# EAGLE schematic SOC_camera (EAGLE 6.2)

## Sheet 1 of 4: Alimentación
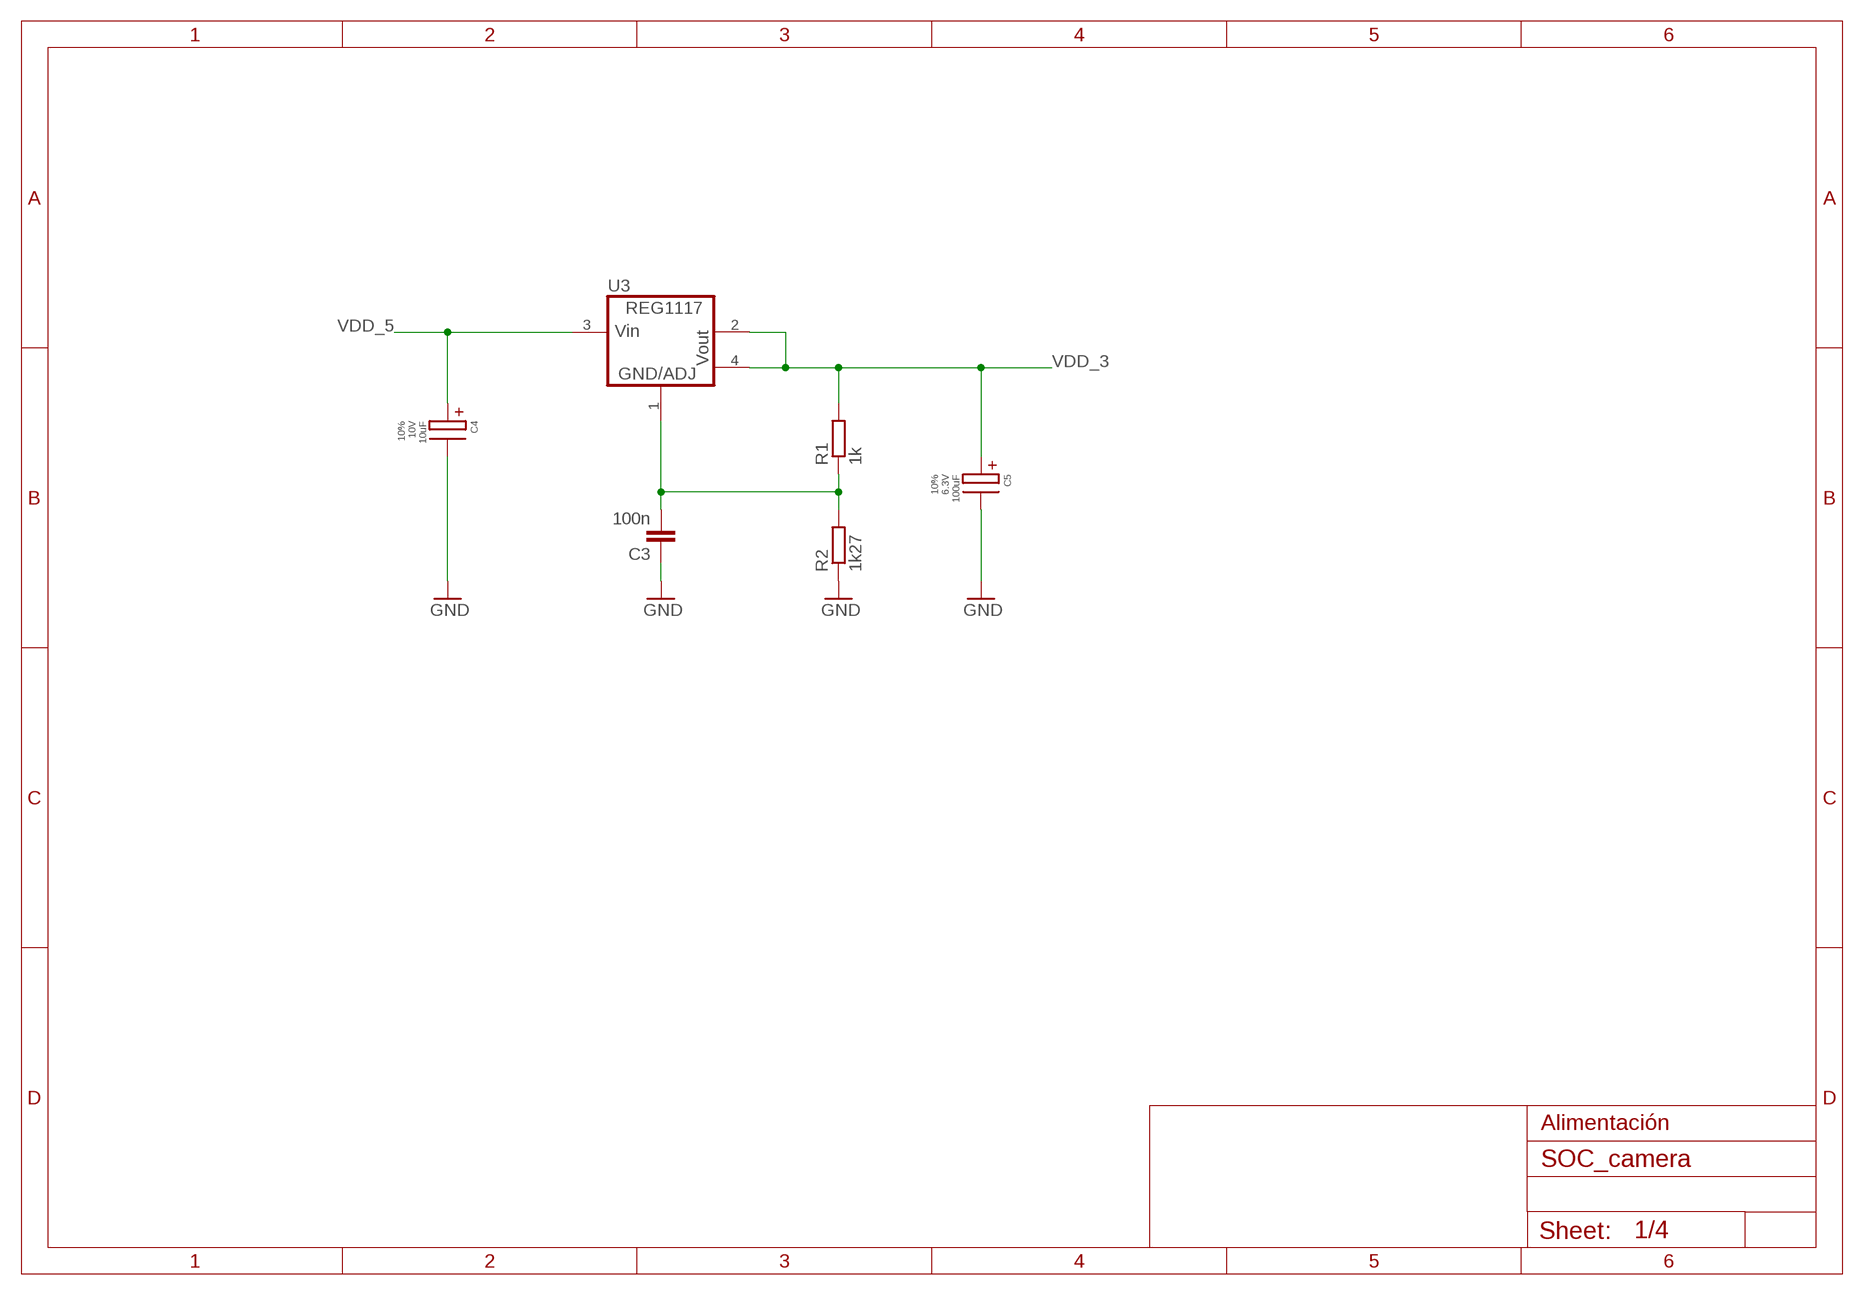
[diagram p0: schematic, sheet 1]

### Parts
C3  100n  C-EUC0603  [C0603]
C4  10uF  CPOL_TF-10U-10V-10%-B  [3528-21]
C5  100uF  CPOL_TF-100U-6V3-10%-B  [3528-21]
R1  1k  R-EU_R0603  [R0603]
R2  1k27  R-EU_R0603  [R0603]
U3  REG1117  [SOT223]

### Nets
GND: C3.1 C4.NEG C5.NEG R2.1 ; also sheet 2,3,4
N$6: C3.2 R1.1 R2.2 U3.1(GND)
VDD_3: C5.POS R1.2 U3.2(VOUT) U3.4(VO2) ; also sheet 2,3
VDD_5: C4.POS U3.3(VIN) ; also sheet 4

### Notes on the sheet
- Alimentación

## Sheet 2 of 4: Divisor de clock
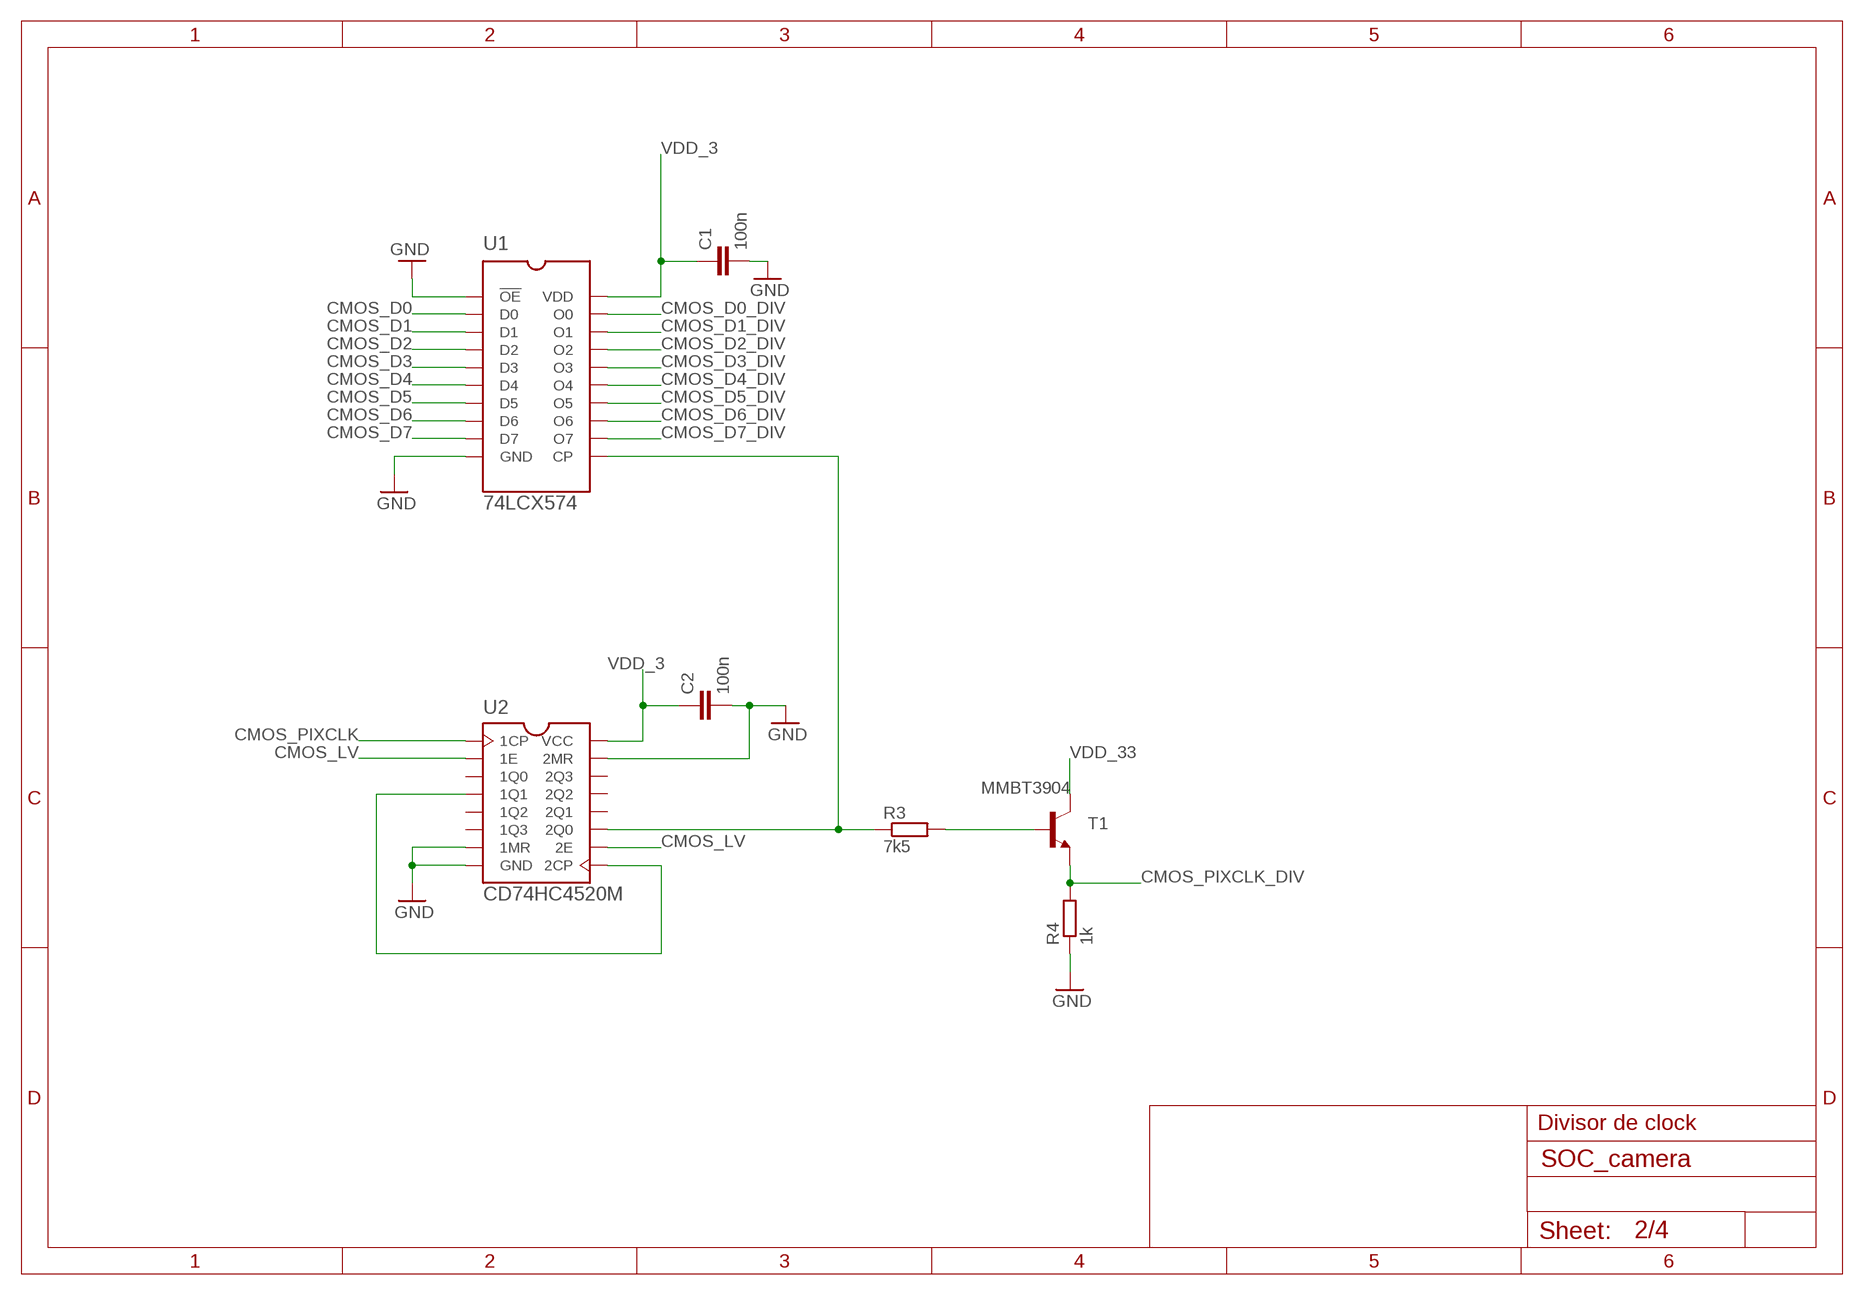
[diagram p1: schematic, sheet 2]

### Parts
C1  100n  C-EUC0603  [C0603]
C2  100n  C-EUC0603  [C0603]
R3  7k5  R-EU_R0603  [R0603]
R4  1k  R-EU_R0603  [R0603]
T1  MMBT3904  MMBT3904LT1-NPN-SOT23-BEC  [SOT23-BEC]
U1  74LCX574  [TSSOP20]
U2  CD74HC4520M  [SOP16]

### Nets
CMOS_D0: U1.2(D0) ; also sheet 3
CMOS_D0_DIV: U1.19(O0) ; also sheet 4
CMOS_D1: U1.3(D1) ; also sheet 3
CMOS_D1_DIV: U1.18(O1) ; also sheet 4
CMOS_D2: U1.4(D2) ; also sheet 3
CMOS_D2_DIV: U1.17(O2) ; also sheet 4
CMOS_D3: U1.5(D3) ; also sheet 3
CMOS_D3_DIV: U1.16(O3) ; also sheet 4
CMOS_D4: U1.6(D4) ; also sheet 3
CMOS_D4_DIV: U1.15(O4) ; also sheet 4
CMOS_D5: U1.7(D5) ; also sheet 3
CMOS_D5_DIV: U1.14(O5) ; also sheet 4
CMOS_D6: U1.8(D6) ; also sheet 3
CMOS_D6_DIV: U1.13(O6) ; also sheet 4
CMOS_D7: U1.9(D7) ; also sheet 3
CMOS_D7_DIV: U1.12(O7) ; also sheet 4
CMOS_LV: U2.2(1E) U2.10(2E) ; also sheet 3,4
CMOS_PIXCLK: U2.1(1CP) ; also sheet 3
CMOS_PIXCLK_DIV: R4.2 T1.E ; also sheet 4
GND: C1.2 C2.2 R4.1 U1.1(!OE) U1.10(GND) U2.7(1MR) U2.8(GND) U2.15(2MR) ; also sheet 1,3,4
N$2: U2.4(1Q1) U2.9(2CP)
N$4: R3.2 T1.B
N$7: R3.1 U1.11(CP) U2.11(2Q0)
VDD_3: C1.1 C2.1 U1.20(VDD) U2.16(VCC) ; also sheet 1,3
VDD_33: T1.C ; also sheet 3,4
Unconnected: U2.3(1Q0) U2.5(1Q2) U2.6(1Q3) U2.12(2Q1) U2.13(2Q2) U2.14(2Q3)

### Notes on the sheet
- Divisor de clock

## Sheet 3 of 4: Camara
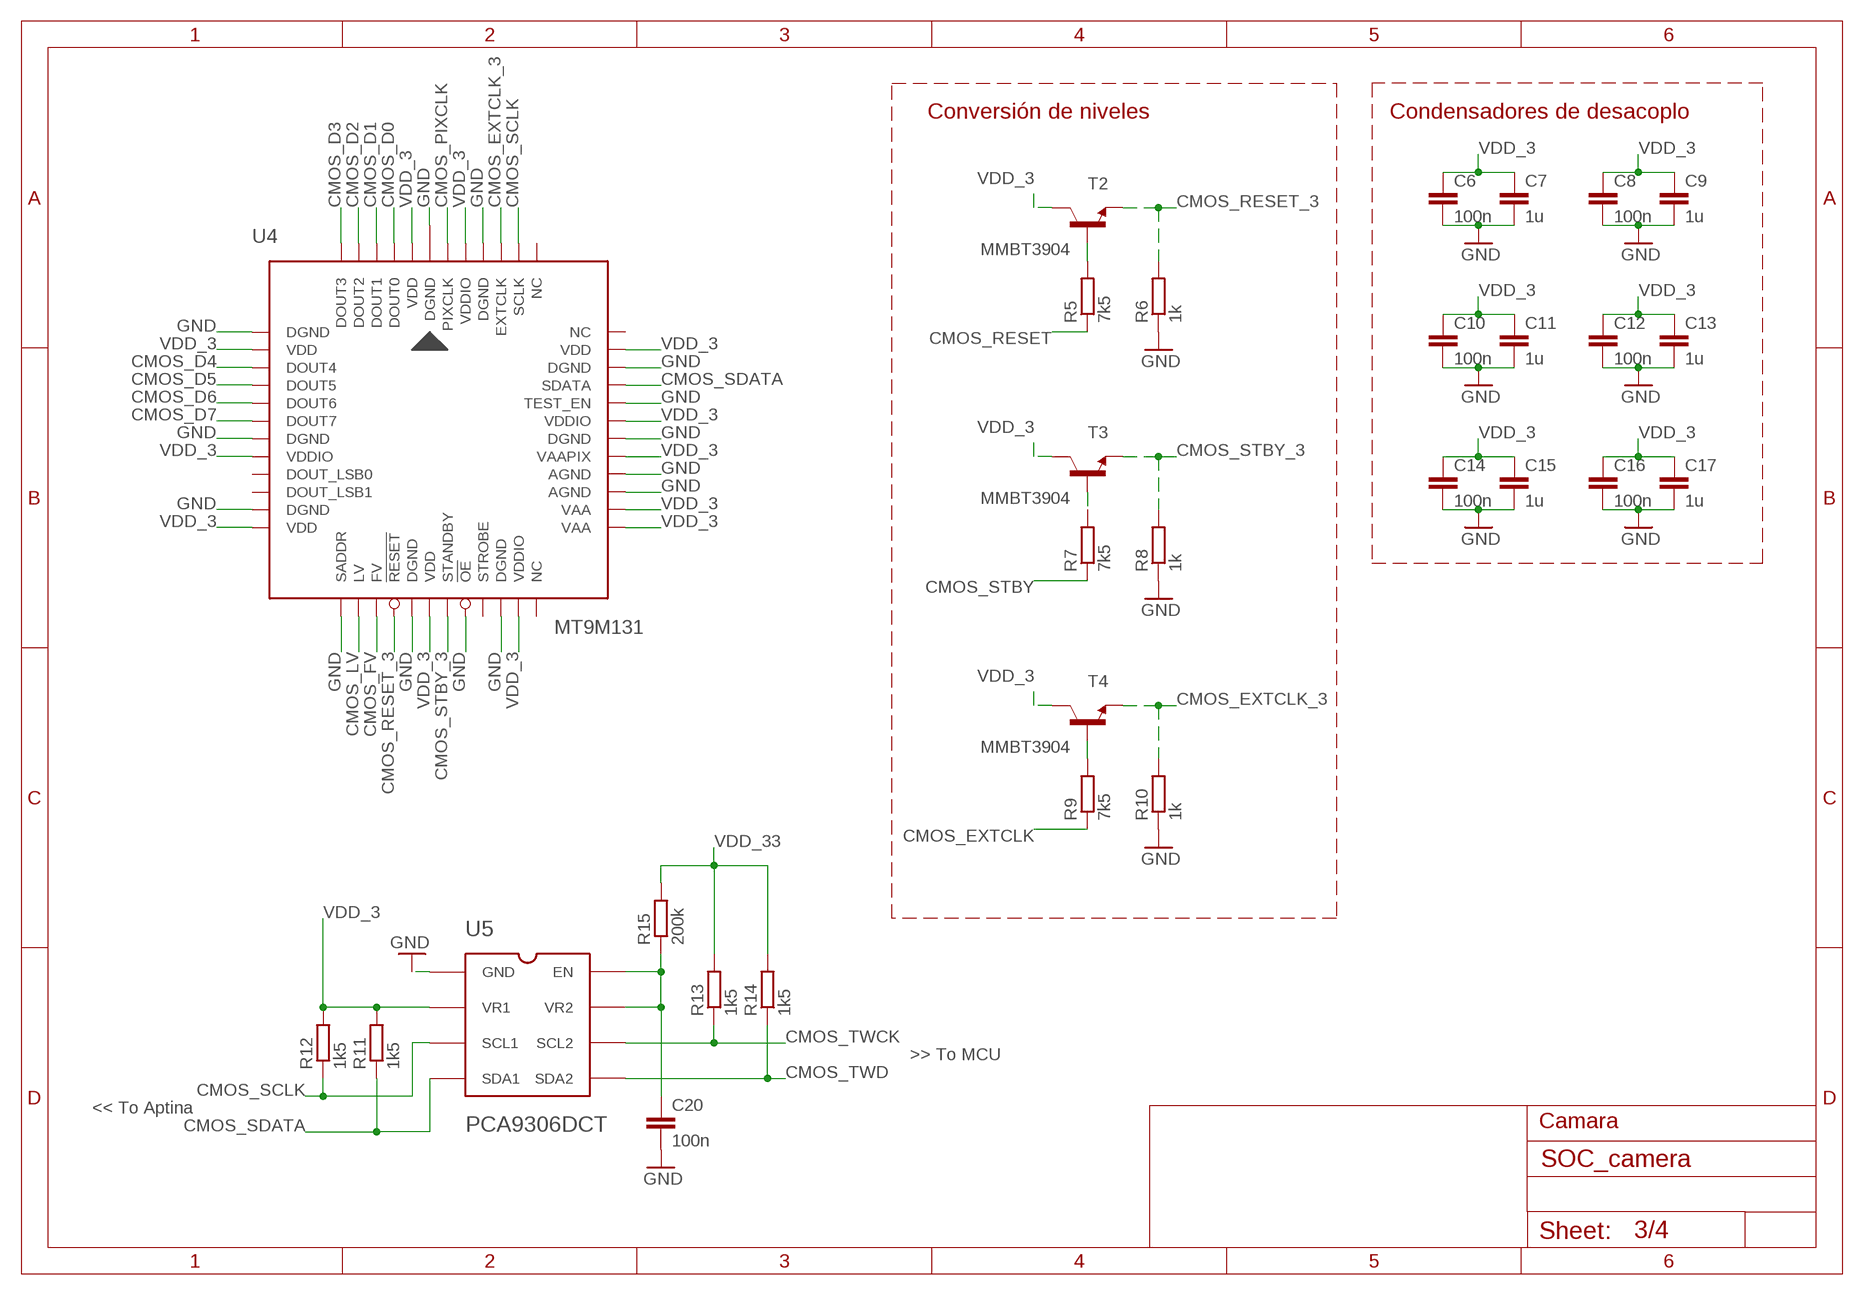
[diagram p2: schematic, sheet 3]

### Parts
C6  100n  C-EUC0402  [C0402]
C7  1u  C-EUC0402  [C0402]
C8  100n  C-EUC0402  [C0402]
C9  1u  C-EUC0402  [C0402]
C10  100n  C-EUC0402  [C0402]
C11  1u  C-EUC0402  [C0402]
C12  100n  C-EUC0402  [C0402]
C13  1u  C-EUC0402  [C0402]
C14  100n  C-EUC0402  [C0402]
C15  1u  C-EUC0402  [C0402]
C16  100n  C-EUC0402  [C0402]
C17  1u  C-EUC0402  [C0402]
C20  100n  C-EUC0402  [C0402]
R5  7k5  R-EU_R0603  [R0603]
R6  1k  R-EU_R0603  [R0603]
R7  7k5  R-EU_R0603  [R0603]
R8  1k  R-EU_R0603  [R0603]
R9  7k5  R-EU_R0603  [R0603]
R10  1k  R-EU_R0603  [R0603]
R11  1k5  R-EU_R0402  [R0402]
R12  1k5  R-EU_R0402  [R0402]
R13  1k5  R-EU_R0402  [R0402]
R14  1k5  R-EU_R0402  [R0402]
R15  200k  R-EU_R0402  [R0402]
T2  MMBT3904  MMBT3904LT1-NPN-SOT23-BEC  [SOT23-BEC]
T3  MMBT3904  MMBT3904LT1-NPN-SOT23-BEC  [SOT23-BEC]
T4  MMBT3904  MMBT3904LT1-NPN-SOT23-BEC  [SOT23-BEC]
U4  MT9M131  [APTINA]
U5  PCA9306DCT  [SSOP8]

### Nets
CMOS_D0: U4.3(DOUT0) ; also sheet 2
CMOS_D1: U4.4(DOUT1) ; also sheet 2
CMOS_D2: U4.5(DOUT2) ; also sheet 2
CMOS_D3: U4.6(DOUT3) ; also sheet 2
CMOS_D4: U4.9(DOUT4) ; also sheet 2
CMOS_D5: U4.10(DOUT5) ; also sheet 2
CMOS_D6: U4.11(DOUT6) ; also sheet 2
CMOS_D7: U4.12(DOUT7) ; also sheet 2
CMOS_EXTCLK: R9.1 ; also sheet 4
CMOS_EXTCLK_3: R10.2 T4.E U4.45(EXTCLK)
CMOS_FV: U4.21(FV) ; also sheet 4
CMOS_LV: U4.20(LV) ; also sheet 2,4
CMOS_PIXCLK: U4.48(PIXCLK) ; also sheet 2
CMOS_RESET: R5.1 ; also sheet 4
CMOS_RESET_3: R6.2 T2.E U4.22(!RESET)
CMOS_SCLK: R12.1 U4.44(SCLK) U5.3(SCL1)
CMOS_SDATA: R11.1 U4.39(SDATA) U5.4(SDA1)
CMOS_STBY: R7.1 ; also sheet 4
CMOS_STBY_3: R8.2 T3.E U4.25(STANDBY)
CMOS_TWCK: R13.1 U5.6(SCL2) ; also sheet 4
CMOS_TWD: R14.1 U5.5(SDA2) ; also sheet 4
GND: C6.2 C7.2 C8.2 C9.2 C10.2 C11.2 C12.2 C13.2 C14.2 C15.2 C16.2 C17.2 C20.2 R6.1 R8.1 R10.1 U4.1(DGND) U4.7(DGND) U4.13(DGND) U4.17(DGND) U4.19(SADDR) U4.23(DGND) U4.26(!OE) U4.28(DGND) U4.33(AGND) U4.34(AGND) U4.36(DGND) U4.38(TEST_EN) U4.40(DGND) U4.46(DGND) U5.1(GND) ; also sheet 1,2,4
N$1: R7.2 T3.B
N$5: R9.2 T4.B
N$9: R5.2 T2.B
N$11: C20.1 R15.1 U5.7(VR2) U5.8(EN)
VDD_3: C6.1 C7.1 C8.1 C9.1 C10.1 C11.1 C12.1 C13.1 C14.1 C15.1 C16.1 C17.1 R11.2 R12.2 T2.C T3.C T4.C U4.2(VDD) U4.8(VDD) U4.14(VDDIO) U4.18(VDD) U4.24(VDD) U4.29(VDDIO) U4.31(VAA) U4.32(VAA) U4.35(VAAPIX) U4.37(VDDIO) U4.41(VDD) U4.47(VDDIO) U5.2(VR1) ; also sheet 1,2
VDD_33: R13.2 R14.2 R15.2 ; also sheet 2,4
Unconnected: U4.15(DOUT_LSB0) U4.16(DOUT_LSB1) U4.27(STROBE) U4.30(NC) U4.42(NC) U4.43(NC)

### Notes on the sheet
- Conversión de niveles | Condensadores de desacoplo
- >> To MCU
- << To Aptina
- Camara

## Sheet 4 of 4: Conectores
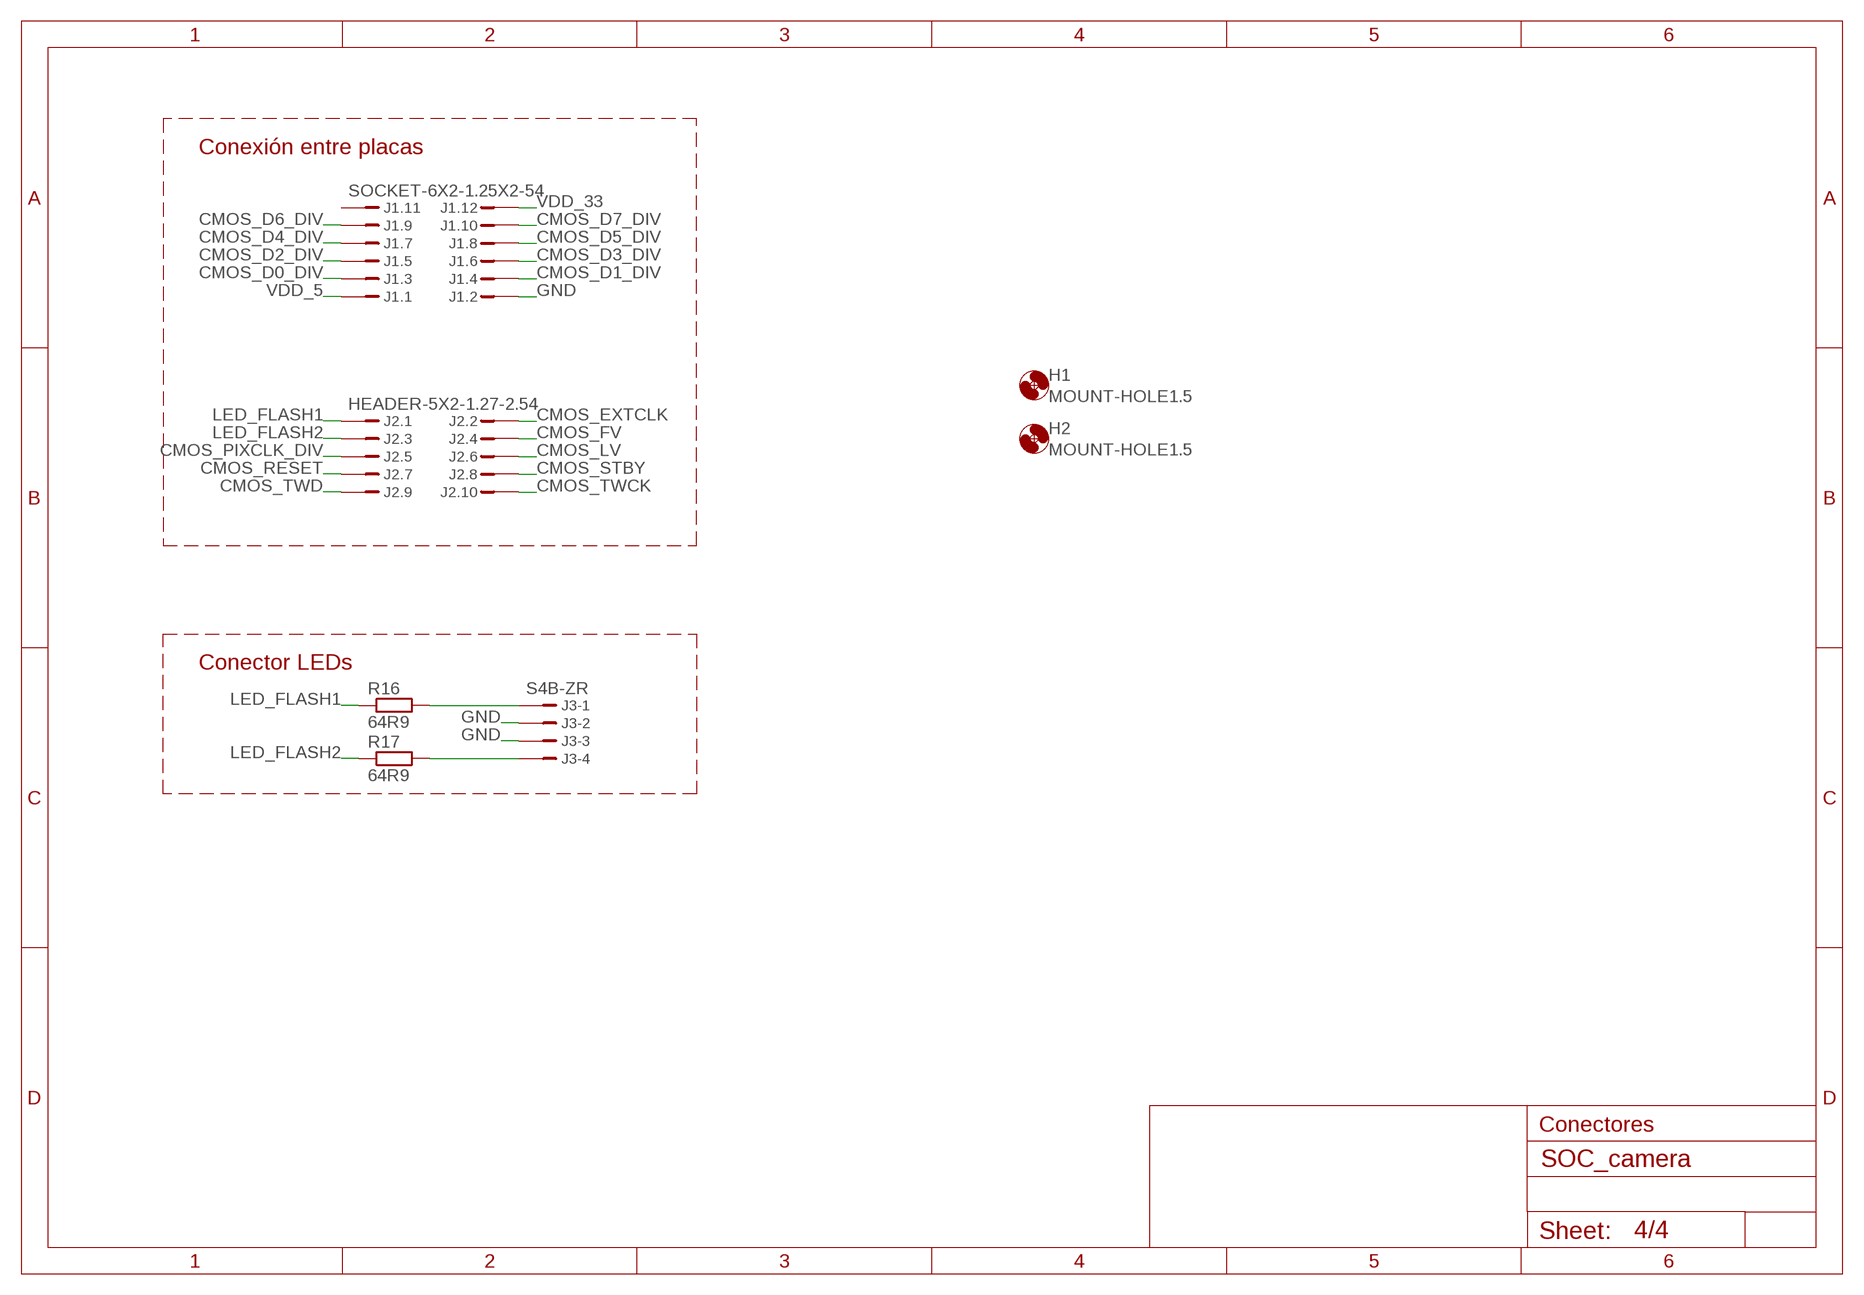
[diagram p3: schematic, sheet 4]

### Parts
H1  MOUNT-HOLE1.5  [1,5]
H2  MOUNT-HOLE1.5  [1,5]
J1  SOCKET-6X2-1.25X2-54  [SOCKET-THD-6X2(1.27X2.54)]
J2  HEADER-5X2-1.27-2.54  [HEADER-THD-5X2(1.27X2.54)]
J3  S4B-ZR  [S4B-ZR]
R16  64R9  R-EU_R0603  [R0603]
R17  64R9  R-EU_R0603  [R0603]

### Nets
CMOS_D0_DIV: J1.P3 ; also sheet 2
CMOS_D1_DIV: J1.P4 ; also sheet 2
CMOS_D2_DIV: J1.P5 ; also sheet 2
CMOS_D3_DIV: J1.P6 ; also sheet 2
CMOS_D4_DIV: J1.P7 ; also sheet 2
CMOS_D5_DIV: J1.P8 ; also sheet 2
CMOS_D6_DIV: J1.P9 ; also sheet 2
CMOS_D7_DIV: J1.P10 ; also sheet 2
CMOS_EXTCLK: J2.2 ; also sheet 3
CMOS_FV: J2.4 ; also sheet 3
CMOS_LV: J2.6 ; also sheet 2,3
CMOS_PIXCLK_DIV: J2.5 ; also sheet 2
CMOS_RESET: J2.7 ; also sheet 3
CMOS_STBY: J2.8 ; also sheet 3
CMOS_TWCK: J2.10 ; also sheet 3
CMOS_TWD: J2.9 ; also sheet 3
GND: J1.P2 J3.2 J3.3 ; also sheet 1,2,3
LED_FLASH1: J2.1 R16.1
LED_FLASH2: J2.3 R17.1
N$3: J3.4 R17.2
N$8: J3.1 R16.2
VDD_5: J1.P1 ; also sheet 1
VDD_33: J1.P12 ; also sheet 2,3
Unconnected: J1.P11

### Notes on the sheet
- Conexión entre placas
- Conector LEDs
- Conectores

## Library data of the parts
C1-C3 C6-C17 C20 = rcl:C-EU: CAPACITOR, European symbol
C4 = tf_condensador_polarizado:CPOL_TF-*: Condensador Polarizado Datasheet <http://www.farnell.com/datasheets/438417.pdf>; MPN: 293D106X9010B2TE3; OC_FARNELL: 175-4163; OC_RS: 684-3888; TOLERANCE: 10%; VOLTAGE: 10V
C5 = tf_condensador_polarizado:CPOL_TF-*: Condensador Polarizado Datasheet <http://www.farnell.com/datasheets/438417.pdf>; MPN: 293D107X96R3B2TE3; OC_FARNELL: 175-4153; OC_RS: 684-3932; TOLERANCE: 10%; VOLTAGE: 6.3V
H1 H2 = tf_holes:MOUNT-HOLE: MOUNTING HOLE with drill center marker
J1 = tf_conectores_thd:SOCKET-6X2-1.25X2-54
J2 = tf_conectores_thd:HEADER-5X2-1.27-2.54: Header 5x2 Header de 2 filas de 5 pines Distáncia entre pines de 1.27mm Distáncia entre filas de 2.54mm
J3 = con-jst:?4B-ZR: ZH CONNECTOR 1.5 mm, 4 pin 1 row Source: http://www.jst.com .. eZH.pdf; MF: FARNELL; MPN: S4B-ZR(LF)(SN); OC_FARNELL: 9491830; OC_NEWARK: 38K8076
R1 R2 R5-R17 = rcl:R-EU_: RESISTOR, European symbol
R3 R4 = resistor:R-EU_: RESISTOR, European symbol
T1-T4 = transistor:*-NPN-: NPN Transistror BF959 corrected 2008.03.06
U1 = tf_biestables:74LCX574: Flip Flop D 8 puertas; MPN: 74LCX574MTCX; OC_FARNELL: 1367340
U2 = tf_contadores:CD74HC4520M: Dual BCD UP-COUNTER
U3 = tf_conversores_DC_DC:REG1117: 800mA and 1A Low Dropout (LDO) Positive Regulator 1.8V, 2.5V, 2.85V, 3.3V, 5V, and Adj; MPN: REG1117
U4 = tf_sensores:MT9M131: Sensor óptico CMOS Datasheet <\\REPOSITORITF\volume1_public\ProyectosN\SOC_1202\Recursos compartidos\datasheets\CCD\Aptina-MT9M131_DS_F.pdf> Fabricante: Aptina Procuct Nº: MT9M131; MPN: MT9M131C12STC; OC_RS: 669-5875
U5 = tf_comunicaciones:PCA9306: Driver I2C Datahseet <\\REPOSITORITF\volume1_public\ProyectosN\SOC_1202\Recursos compartidos\datasheets\CCD\I2C-leveltranslator.pdf> Conversor de niveles I2C; MPN: PCA9306DCTR; OC_FARNELL: 1470936; OC_RS: 662-7415